# Altium schematic sheet ArmPcb.SchDoc
size A2
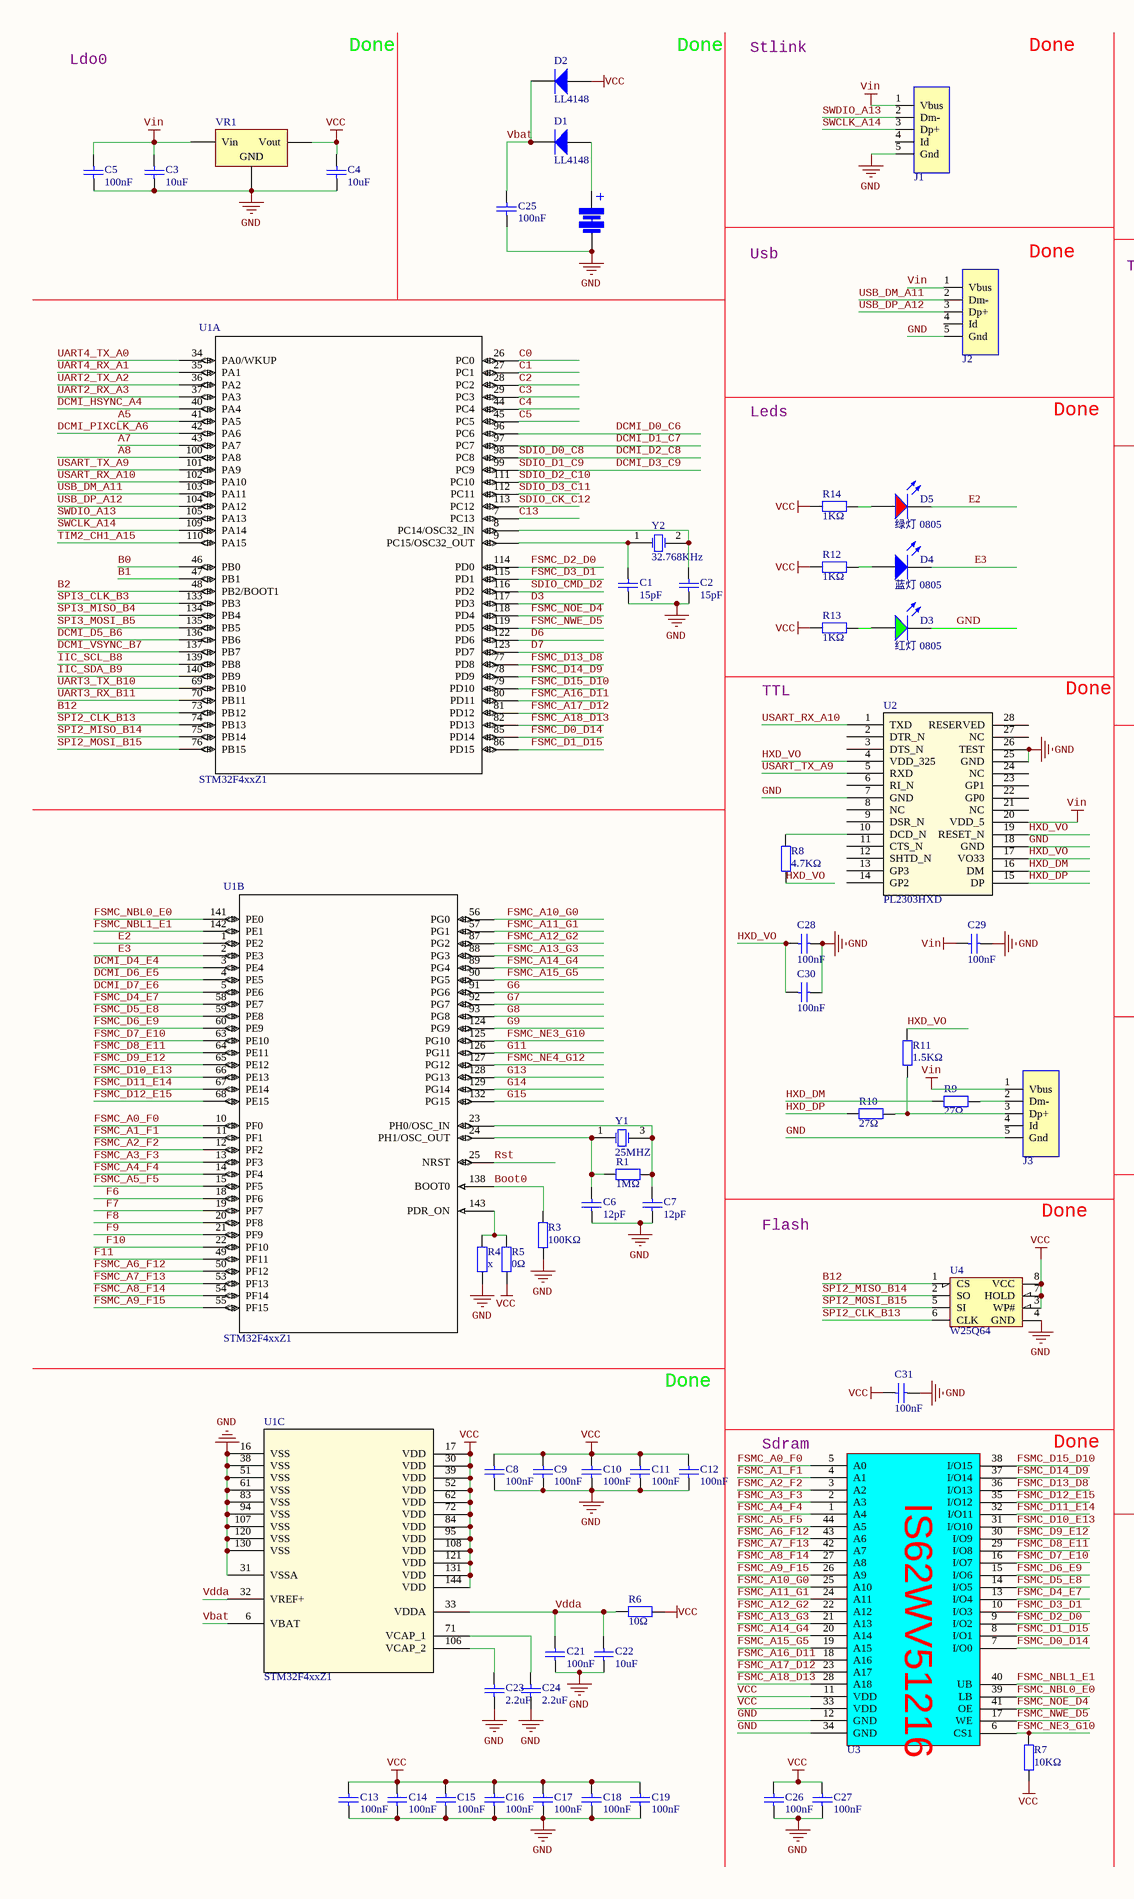
[diagram p0: ArmPcb.SchDoc, left]
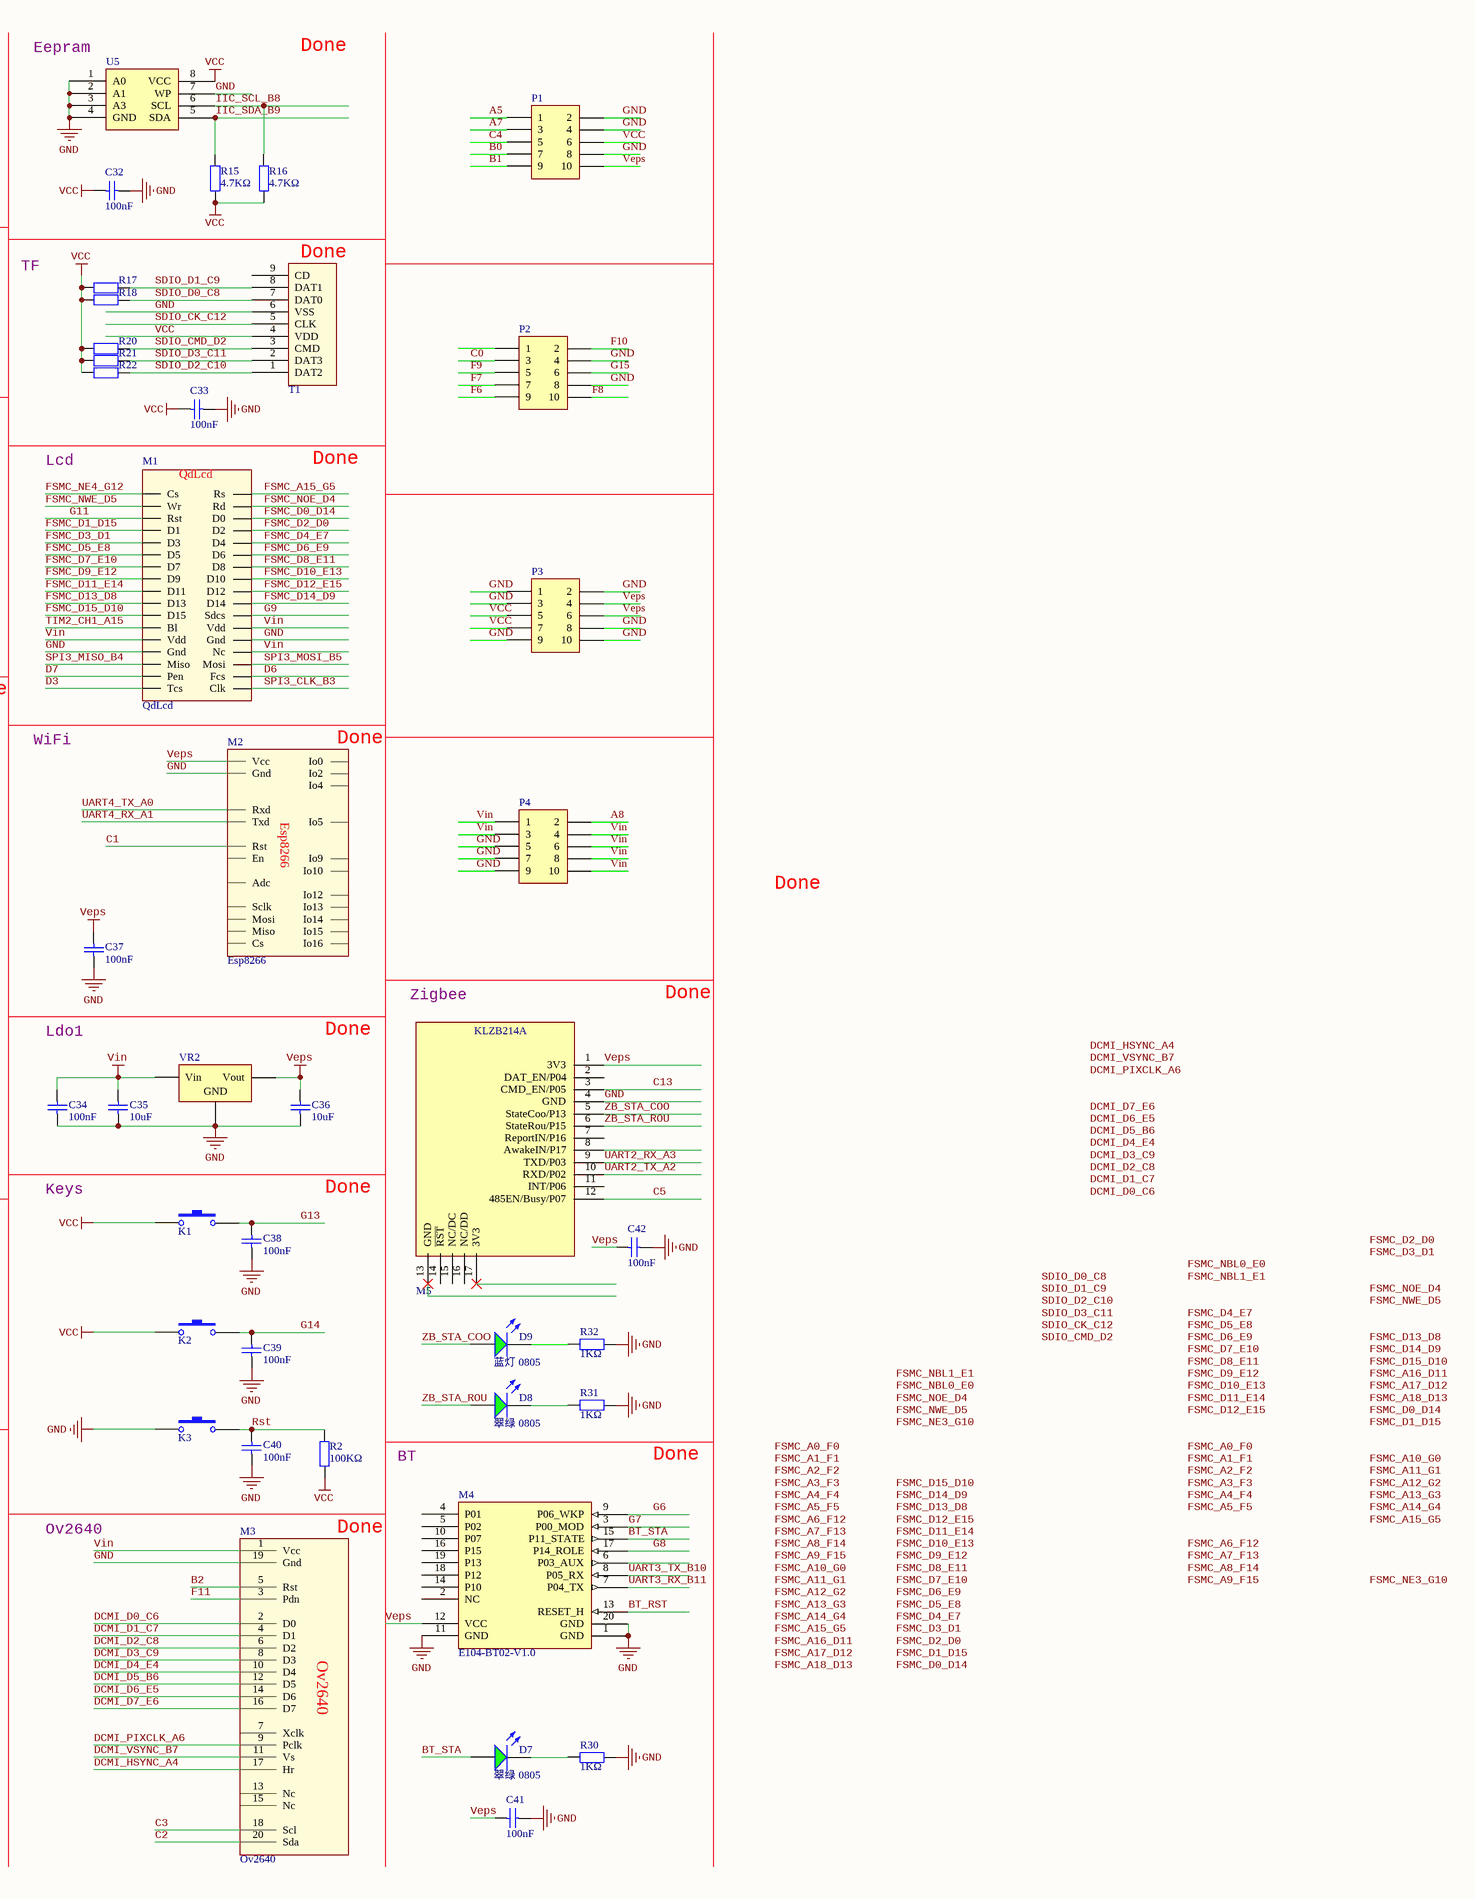
[diagram p1: ArmPcb.SchDoc, right]

## Parts
B1  BATTERY  [BATTERY]  (value not drawn)
C1  15pF  [0603_C]
C2  15pF  [0603_C]
C3  10uF  [0805_C]
C4  10uF  [0805_C]
C5  100nF  [0603_C]
C6  12pF  [0603_C]
C7  12pF  [0603_C]
C8  100nF  [0603_C]
C9  100nF  [0603_C]
C10  100nF  [0603_C]
C11  100nF  [0603_C]
C12  100nF  [0603_C]
C13  100nF  [0603_C]
C14  100nF  [0603_C]
C15  100nF  [0603_C]
C16  100nF  [0603_C]
C17  100nF  [0603_C]
C18  100nF  [0603_C]
C19  100nF  [0603_C]
C21  100nF  [0603_C]
C22  10uF  [0603_C]
C23  2.2uF  [0603_C]
C24  2.2uF  [0603_C]
C25  100nF  [0603_C]
C26  100nF  [0603_C]
C27  100nF  [0603_C]
C28  100nF  [0603_C]
C29  100nF  [0603_C]
C30  100nF  [0603_C]
C31  100nF  [0603_C]
C32  100nF  [0603_C]
C33  100nF  [0603_C]
C34  100nF  [0603_C]
C35  10uF  [0805_C]
C36  10uF  [0805_C]
C37  100nF  [0603_C]
C38  100nF  [0603_C]
C39  100nF  [0603_C]
C40  100nF  [0603_C]
C41  100nF  [0603_C]
C42  100nF  [0603_C]
D1  LL4148  [LL-34]
D2  LL4148  [LL-34]
D3  红灯 0805  [0805_LED_S1]
D4  蓝灯 0805  [0805_LED_S1]
D5  绿灯 0805  [0805_LED_S1]
D7  翠绿 0805  [0805_LED_S1]
D8  翠绿 0805  [0805_LED_S1]
D9  蓝灯 0805  [0805_LED_S1]
J1  UsbOtg  [USB-MINI-A]  (value not drawn)
J2  UsbOtg  [USB-MICRO_E]  (value not drawn)
J3  UsbOtg  [USB-MICRO_E]  (value not drawn)
K1  SW  [SWITCH]  (value not drawn)
K2  SW  [SWITCH]  (value not drawn)
K3  SW  [SWITCH]  (value not drawn)
M1  QdLcd  [TFTLCD]
M2  Esp8266  [ESP8266]
M3  Ov2640  [FPC0.5 OV2640]
M4  E104-BT02-V1.0  [PE104-BT02]
M5  KLZB214A  [KLZB214A_M]  (value not drawn)
P1  Header 5X2  [HDR2.54-M-LS-2x5P]  (value not drawn)
P2  Header 5X2  [HDR2.54-M-LS-2x5P]  (value not drawn)
P3  Header 5X2  [HDR2.54-M-LS-2x5P]  (value not drawn)
P4  Header 5X2  [HDR2.54-M-LS-2x5P]  (value not drawn)
R1  1MΩ  [0603_R]
R2  100KΩ  [0603_R]
R3  100KΩ  [0603_R]
R4  x  [0603_R]
R5  0Ω  [0603_R]
R6  10Ω  [0603_R]
R7  10KΩ  [0603_R]
R8  4.7KΩ  [0603_R]
R9  27Ω  [0603_R]
R10  27Ω  [0603_R]
R11  1.5KΩ  [0603_R]
R12  1KΩ  [0603_R]
R13  1KΩ  [0603_R]
R14  1KΩ  [0603_R]
R15  4.7KΩ  [0603_R]
R16  4.7KΩ  [0603_R]
R17  47KΩ  [0603_R]  (value not drawn)
R18  47KΩ  [0603_R]  (value not drawn)
R20  47KΩ  [0603_R]  (value not drawn)
R21  47KΩ  [0603_R]  (value not drawn)
R22  47KΩ  [0603_R]  (value not drawn)
R30  1KΩ  [0603_R]
R31  1KΩ  [0603_R]
R32  1KΩ  [0603_R]
T1  TFCard  [TF-CARD]  (value not drawn)
U1  STM32F4xxZ1  [LQFP144]  (parts A,B,C of 3)
U2  PL2303HXD  [SSOP28]
U3  IS62WV51216  [TSOP44]  (value not drawn)
U4  W25Q64  [SOP8_W]
U5  EAT24C256C  [SOP8_L]  (value not drawn)
VR1  AMS1117-3.3  [SOT-223]  (value not drawn)
VR2  AMS1117-3.3  [SOT-223]  (value not drawn)
Y1  25MHZ  [SMD-3225_4P]
Y2  32.768KHz  [SMD-3215_2P FC - 135]

## Nets
GND: B1.2(-) C1.1 C2.1 C3.1 C4.1 C5.1 C6.1 C7.1 C8.1 C9.1 C10.1 C11.1 C12.1 C13.1 C14.1 C15.1 C16.1 C17.1 C18.1 C19.1 C21.1 C22.1 C23.1 C24.1 C25.1 C26.1 C27.1 C28.1 C29.1 C30.1 C31.2 C32.2 C33.2 C34.1 C35.1 C36.1 C37.1 C38.1 C39.1 C40.1 C41.1 C42.1 D3.K J1.5(Gnd) J2.5(Gnd) J3.5(Gnd) K3.1 M1.26(Gnd) M1.27(Gnd) M2.15(Gnd) M3.19(Gnd) M4.1(GND) M4.11(GND) M4.20(GND) M5.4(GND) P1.2 P1.4 P1.8 P2.4 P2.8 P3.1 P3.2 P3.3 P3.8 P3.9 P3.10 P4.5 P4.7 P4.9 R3.1 R4.1 R30.1 R31.1 R32.1 T1.6(VSS) U1.16(VSS) U1.31(VSSA) U1.38(VSS) U1.51(VSS) U1.61(VSS) U1.83(VSS) U1.94(VSS) U1.107(VSS) U1.120(VSS) U1.130(VSS) U2.7(GND) U2.18(GND) U2.25(GND) U2.26(TEST) U3.12(GND) U3.34(GND) U4.4(GND) U5.1(A0) U5.2(A1) U5.3(A3) U5.4(GND) U5.7(WP) VR1.1(GND) VR2.1(GND)
VCC: C4.2 C8.2 C9.2 C10.2 C11.2 C12.2 C13.2 C14.2 C15.2 C16.2 C17.2 C18.2 C19.2 C26.2 C27.2 C31.1 C32.1 C33.1 D2.1(A) K1.1 K2.1 P1.6 P3.5 P3.7 R2.1 R5.1 R6.2 R7.1 R12.2 R13.2 R14.2 R15.2 R16.2 R17.1 R18.1 R20.1 R21.1 R22.1 T1.4(VDD) U1.17(VDD) U1.30(VDD) U1.39(VDD) U1.52(VDD) U1.62(VDD) U1.72(VDD) U1.84(VDD) U1.95(VDD) U1.108(VDD) U1.121(VDD) U1.131(VDD) U1.144(VDD) U3.11(VDD) U3.33(VDD) U4.3(WP#) U4.7(HOLD) U4.8(VCC) U5.8(VCC) VR1.2(Vout)
Veps: C36.2 C37.2 C41.2 C42.2 M2.8(Vcc) M4.12(VCC) M5.1(3V3) P1.10 P3.4 P3.6 VR2.2(Vout)
Vin: C3.2 C5.2 C29.2 C34.2 C35.2 J1.1(Vbus) J2.1(Vbus) J3.1(Vbus) M1.24(Vdd) M1.25(Vdd) M1.28(Nc) M3.1(Vcc) P4.1 P4.3 P4.4 P4.6 P4.8 P4.10 U2.20(VDD_5) VR1.3(Vin) VR2.3(Vin)
A5: P1.1 U1.41(PA5)
A7: P1.3 U1.43(PA7)
A8: P4.2 U1.100(PA8)
B0: P1.7 U1.46(PB0)
B1: P1.9 U1.47(PB1)
B2: M3.5(Rst) U1.48(PB2/BOOT1)
B12: U1.73(PB12) U4.1(CS)
Boot0: R3.2 U1.138(BOOT0)
BT_RST: M4.13(RESET_H)
BT_STA: D7.A M4.15(P11_STATE)
C0: P2.3 U1.26(PC0)
C1: M2.1(Rst) U1.27(PC1)
C2: M3.20(Sda) U1.28(PC2)
C3: M3.18(Scl) U1.29(PC3)
C4: P1.5 U1.44(PC4)
C5: M5.12(485EN/Busy/P07) U1.45(PC5)
C13: M5.3(CMD_EN/P05) U1.7(PC13)
D3: M1.33(Tcs) U1.117(PD3)
D6: M1.32(Fcs) U1.122(PD6)
D7: M1.31(Pen) U1.123(PD7)
DCMI_D0_C6: M3.2(D0) U1.96(PC6)
DCMI_D1_C7: M3.4(D1) U1.97(PC7)
DCMI_D2_C8: M3.6(D2) R18.2 T1.7(DAT0) U1.98(PC8)  [also labelled SDIO_D0_C8]
DCMI_D3_C9: M3.8(D3) R17.2 T1.8(DAT1) U1.99(PC9)  [also labelled SDIO_D1_C9]
DCMI_D4_E4: M3.10(D4) U1.3(PE4)
DCMI_D5_B6: M3.12(D5) U1.136(PB6)
DCMI_D6_E5: M3.14(D6) U1.4(PE5)
DCMI_D7_E6: M3.16(D7) U1.5(PE6)
DCMI_HSYNC_A4: M3.17(Hr) U1.40(PA4)
DCMI_PIXCLK_A6: M3.9(Pclk) U1.42(PA6)
DCMI_VSYNC_B7: M3.11(Vs) U1.137(PB7)
E2: D5.K U1.1(PE2)
E3: D4.K U1.2(PE3)
F6: P2.9 U1.18(PF6)
F7: P2.7 U1.19(PF7)
F8: P2.10 U1.20(PF8)
F9: P2.5 U1.21(PF9)
F10: P2.2 U1.22(PF10)
F11: M3.3(Pdn) U1.49(PF11)
FSMC_A0_F0: U1.10(PF0) U3.5(A0)
FSMC_A1_F1: U1.11(PF1) U3.4(A1)
FSMC_A2_F2: U1.12(PF2) U3.3(A2)
FSMC_A3_F3: U1.13(PF3) U3.2(A3)
FSMC_A4_F4: U1.14(PF4) U3.1(A4)
FSMC_A5_F5: U1.15(PF5) U3.44(A5)
FSMC_A6_F12: U1.50(PF12) U3.43(A6)
FSMC_A7_F13: U1.53(PF13) U3.42(A7)
FSMC_A8_F14: U1.54(PF14) U3.27(A8)
FSMC_A9_F15: U1.55(PF15) U3.26(A9)
FSMC_A10_G0: U1.56(PG0) U3.25(A10)
FSMC_A11_G1: U1.57(PG1) U3.24(A11)
FSMC_A12_G2: U1.87(PG2) U3.22(A12)
FSMC_A13_G3: U1.88(PG3) U3.21(A13)
FSMC_A14_G4: U1.89(PG4) U3.20(A14)
FSMC_A15_G5: M1.2(Rs) U1.90(PG5) U3.19(A15)
FSMC_A16_D11: U1.80(PD11) U3.18(A16)
FSMC_A17_D12: U1.81(PD12) U3.23(A17)
FSMC_A18_D13: U1.82(PD13) U3.28(A18)
FSMC_D0_D14: M1.6(D0) U1.85(PD14) U3.7(I/O0)
FSMC_D1_D15: M1.7(D1) U1.86(PD15) U3.8(I/O1)
FSMC_D2_D0: M1.8(D2) U1.114(PD0) U3.9(I/O2)
FSMC_D3_D1: M1.9(D3) U1.115(PD1) U3.10(I/O3)
FSMC_D4_E7: M1.10(D4) U1.58(PE7) U3.13(I/O4)
FSMC_D5_E8: M1.11(D5) U1.59(PE8) U3.14(I/O5)
FSMC_D6_E9: M1.12(D6) U1.60(PE9) U3.15(I/O6)
FSMC_D7_E10: M1.13(D7) U1.63(PE10) U3.16(I/O7)
FSMC_D8_E11: M1.14(D8) U1.64(PE11) U3.29(I/O8)
FSMC_D9_E12: M1.15(D9) U1.65(PE12) U3.30(I/O9)
FSMC_D10_E13: M1.16(D10) U1.66(PE13) U3.31(I/O10)
FSMC_D11_E14: M1.17(D11) U1.67(PE14) U3.32(I/O11)
FSMC_D12_E15: M1.18(D12) U1.68(PE15) U3.35(I/O12)
FSMC_D13_D8: M1.19(D13) U1.77(PD8) U3.36(I/O13)
FSMC_D14_D9: M1.20(D14) U1.78(PD9) U3.37(I/O14)
FSMC_D15_D10: M1.21(D15) U1.79(PD10) U3.38(I/O15)
FSMC_NBL0_E0: U1.141(PE0) U3.39(LB)
FSMC_NBL1_E1: U1.142(PE1) U3.40(UB)
FSMC_NE3_G10: R7.2 U1.125(PG10) U3.6(CS1)
FSMC_NE4_G12: M1.1(Cs) U1.127(PG12)
FSMC_NOE_D4: M1.4(Rd) U1.118(PD4) U3.41(OE)
FSMC_NWE_D5: M1.3(Wr) U1.119(PD5) U3.17(WE)
G6: M4.9(P06_WKP) U1.91(PG6)
G7: M4.3(P00_MOD) U1.92(PG7)
G8: M4.17(P14_ROLE) U1.93(PG8)
G9: M1.22(Sdcs) U1.124(PG9)
G11: M1.5(Rst) U1.126(PG11)
G13: C38.2 K1.2 U1.128(PG13)
G14: C39.2 K2.2 U1.129(PG14)
G15: P2.6 U1.132(PG15)
HXD_DM: R9.1 U2.16(DM)
HXD_DP: R10.1 U2.15(DP)
HXD_VO: C28.2 C30.2 R8.2 R11.2 U2.4(VDD_325) U2.17(VO33) U2.19(RESET_N)
IIC_SCL_B8: R16.1 U1.139(PB8) U5.6(SCL)
IIC_SDA_B9: R15.1 U1.140(PB9) U5.5(SDA)
Rst: C40.2 K3.2 R2.2 U1.25(NRST)
SDIO_CK_C12: T1.5(CLK) U1.113(PC12)
SDIO_CMD_D2: R20.2 T1.3(CMD) U1.116(PD2)
SDIO_D2_C10: R22.2 T1.1(DAT2) U1.111(PC10)
SDIO_D3_C11: R21.2 T1.2(DAT3) U1.112(PC11)
SPI2_CLK_B13: U1.74(PB13) U4.6(CLK)
SPI2_MISO_B14: U1.75(PB14) U4.2(SO)
SPI2_MOSI_B15: U1.76(PB15) U4.5(SI)
SPI3_CLK_B3: M1.34(Clk) U1.133(PB3)
SPI3_MISO_B4: M1.29(Miso) U1.134(PB4)
SPI3_MOSI_B5: M1.30(Mosi) U1.135(PB5)
SWCLK_A14: J1.3(Dp+) U1.109(PA14)
SWDIO_A13: J1.2(Dm-) U1.105(PA13)
TIM2_CH1_A15: M1.23(Bl) U1.110(PA15)
UART2_RX_A3: M5.9(TXD/P03) U1.37(PA3)
UART2_TX_A2: M5.10(RXD/P02) U1.36(PA2)
UART3_RX_B11: M4.7(P04_TX) U1.70(PB11)
UART3_TX_B10: M4.8(P05_RX) U1.69(PB10)
UART4_RX_A1: M2.22(Txd) U1.35(PA1)
UART4_TX_A0: M2.21(Rxd) U1.34(PA0/WKUP)
USART_RX_A10: U1.102(PA10) U2.1(TXD)
USART_TX_A9: U1.101(PA9) U2.5(RXD)
USB_DM_A11: J2.2(Dm-) U1.103(PA11)
USB_DP_A12: J2.3(Dp+) U1.104(PA12)
Vbat: C25.2 D1.2(K) D2.2(K) U1.6(VBAT)
Vdda: C21.2 C22.2 R6.1 U1.32(VREF+) U1.33(VDDA)
ZB_STA_COO: D9.A M5.5(StateCoo/P13)
ZB_STA_ROU: D8.A M5.6(StateRou/P15)
NetB1_1: B1.1(+) D1.1(A)
NetC1_2: C1.2 U1.9(PC15/OSC32_OUT) Y2.1(OSC1)
NetC2_2: C2.2 U1.8(PC14/OSC32_IN) Y2.2(OSC2)
NetC6_2: C6.2 R1.1 U1.24(PH1/OSC_OUT) Y1.1(OSC1)
NetC7_2: C7.2 R1.2 U1.23(PH0/OSC_IN) Y1.3(OSC2)
NetC23_2: C23.2 U1.106(VCAP_2)
NetC24_2: C24.2 U1.71(VCAP_1)
NetD3_A: D3.A R13.1
NetD4_A: D4.A R12.1
NetD5_A: D5.A R14.1
NetD7_K: D7.K R30.2
NetD8_K: D8.K R31.2
NetD9_K: D9.K R32.2
NetJ3_2: J3.2(Dm-) R9.2
NetJ3_3: J3.3(Dp+) R10.2 R11.1
NetR4_2: R4.2 R5.2 U1.143(PDR_ON)
NetR8_1: R8.1 U2.10(DCD_N)

Not connected (* = marked no-connect by the designer): J1 4(Id); J2 4(Id); J3 4(Id); M2 2(Adc) 3(En) 4(Io16) 5(Io14) 6(Io12) 7(Io13) 9(Sclk) 10(Mosi) 11(Io10) 12(Io9) 13(Miso) 14(Cs) 16(Io15) 17(Io2) 18(Io0) 19(Io4) 20(Io5); M3 7(Xclk) 13(Nc) 15(Nc); M4 2(NC) 4(P01) 5(P02) 6(P03_AUX) 10(P07) 14(P10) 16(P15) 18(P12) 19(P13); M5 2(DAT_EN/P04) 7(ReportIN/P16) 8(AwakeIN/P17) 11(INT/P06) 13(GND)* 14(~{RST}) 15(NC/DC) 16(NC/DD) 17(3V3)*; P2 1; T1 9(CD); U2 2(DTR_N) 3(DTS_N) 6(RI_N) 8(NC) 9(DSR_N) 11(CTS_N) 12(SHTD_N) 13(GP3) 14(GP2) 21(NC) 22(GP0) 23(GP1) 24(NC) 27(NC) 28(RESERVED)

## Notes on the sheet
- Ldo0
- Done
- Stlink
- (near U5) Eepram
- Usb
- TF
- (near T1) Done
- Leds
- Lcd
- TTL
- WiFi
- (near M2) Done
- Zigbee
- Ldo1
- Keys
- Flash
- Sdram
- BT
- Ov2640
- Labels drawn without touching a wire or pin: DCMI_D0_C6, DCMI_D1_C7, DCMI_D2_C8, DCMI_D3_C9, DCMI_D4_E4, DCMI_D5_B6, DCMI_D6_E5, DCMI_D7_E6, DCMI_HSYNC_A4, DCMI_PIXCLK_A6, DCMI_VSYNC_B7, FSMC_A0_F0, FSMC_A1_F1, FSMC_A2_F2, FSMC_A3_F3, FSMC_A4_F4, FSMC_A5_F5, FSMC_A6_F12, FSMC_A7_F13, FSMC_A8_F14, FSMC_A9_F15, FSMC_A10_G0, FSMC_A11_G1, FSMC_A12_G2, FSMC_A13_G3, FSMC_A14_G4, FSMC_A15_G5, FSMC_A16_D11, FSMC_A17_D12, FSMC_A18_D13, FSMC_D0_D14, FSMC_D1_D15, FSMC_D2_D0, FSMC_D3_D1, FSMC_D4_E7, FSMC_D5_E8, FSMC_D6_E9, FSMC_D7_E10, FSMC_D8_E11, FSMC_D9_E12, FSMC_D10_E13, FSMC_D11_E14, FSMC_D12_E15, FSMC_D13_D8, FSMC_D14_D9, FSMC_D15_D10, FSMC_NBL0_E0, FSMC_NBL1_E1, FSMC_NE3_G10, FSMC_NOE_D4, FSMC_NWE_D5, SDIO_CK_C12, SDIO_CMD_D2, SDIO_D0_C8, SDIO_D1_C9, SDIO_D2_C10, SDIO_D3_C11
- Title
- Size:
- Date:
- File:
- A2
- Number:
- Time:
- Revision:
- Sheet
- of

## Library data of the parts
B1 = BATTERY: 纽扣电池
C1 C2 = 0603 15pF (150) 5% 50V: 贴片电容; ComponentLink1Description: 供应商链接; ComponentLink1URL: http://www.szlcsc.com/product/details_1996.html; Package: 0603; Supplier: LC; SuppliersPartNumber: C1644
C3 C4 C35 C36 = 0805 10uF (106) 10% 25V: 贴片电容; ComponentLink1Description: 供应商链接; ComponentLink1URL: http://www.szlcsc.com/product/details_16532.html; Package: 0805; Supplier: LC; SuppliersPartNumber: C15850
C5 C8-C19 C21 C25-C34 C37-C42 = 0603 100nF (104) 10% 50V: 贴片电容; ComponentLink1Description: 供应商链接; ComponentLink1URL: http://www.szlcsc.com/product/details_15331.html; Package: 0603; Supplier: LC; SuppliersPartNumber: C14663
C6 C7 = 0603 12pF (120) 5% 50V: 贴片电容; ComponentLink1Description: 供应商链接; ComponentLink1URL: http://www.szlcsc.com/product/details_39506.html; Package: 0603; Supplier: LC; SuppliersPartNumber: C38523
C22 = 0603 10uF (106) 10% 10V: 贴片电容; ComponentLink1Description: 供应商链接; ComponentLink1URL: http://www.szlcsc.com/product/details_20411.html; Package: 0603; Supplier: LC; SuppliersPartNumber: C19702
C23 C24 = 0603 2.2uF (225) 10% 16V: 贴片电容; ComponentLink1Description: 供应商链接; ComponentLink1URL: http://www.szlcsc.com/product/details_24366.html; Package: 0603; Supplier: LC; SuppliersPartNumber: C23630
D1 D2 = LL-34 LL4148 LL-34 1206: 开关二极管; ComponentLink1Description: 供应商链接; ComponentLink1URL: http://www.szlcsc.com/product/details_10338.html; Package: LL-34; Supplier: LC; SuppliersPartNumber: C9808
D3 D7-D9 = 0805 翠绿: 发光二极管; ComponentLink1Description: 供应商链接; ComponentLink1URL: http://www.szlcsc.com/product/details_2670.html; Package: 0805; Supplier: LC; SuppliersPartNumber: C2297
D4 = 0805 蓝灯: 发光二极管; ComponentLink1Description: 供应商链接; ComponentLink1URL: http://www.szlcsc.com/product/details_2666.html; Package: 0805; Supplier: LC; SuppliersPartNumber: C2293
D5 = 0805 红灯: 发光二极管; ComponentLink1Description: 供应商链接; ComponentLink1URL: http://www.szlcsc.com/product/details_2668.html; Package: 0805; Supplier: LC; SuppliersPartNumber: C2295
K1-K3 = SW: Switch
M5 = KLZB214A: zigbee to uart
P1-P4 = Header 5X2: Header, 5-Pin, Dual row; LatestRevisionDate: 17-Jul-2002; LatestRevisionNote: Re-released for DXP Platform.; Publisher: Altium Limited
R1 = 0603 1MΩ (1004) 1%: 贴片电阻; ComponentLink1Description: 供应商链接; ComponentLink1URL: http://www.szlcsc.com/product/details_23662.html; Package: 0603; Supplier: LC; SuppliersPartNumber: C22935
R2 R3 = 0603 100KΩ (1003) 1%: 贴片电阻; ComponentLink1Description: 供应商链接; ComponentLink1URL: http://www.szlcsc.com/product/details_26546.html; Package: 0603; Supplier: LC; SuppliersPartNumber: C25803
R4 R5 = 0603 0Ω (0R0) 1%: 贴片电阻; ComponentLink1Description: 供应商链接; ComponentLink1URL: http://www.szlcsc.com/product/details_21903.html; Package: 0603; Supplier: LC; SuppliersPartNumber: C21189
R6 = 0603 10Ω (10R0) 1%: 贴片电阻; ComponentLink1Description: 供应商链接; ComponentLink1URL: http://www.szlcsc.com/product/details_23586.html; Package: 0603; Supplier: LC; SuppliersPartNumber: C22859
R7-R16 R30-R32 = 0603 10KΩ (1002) 1%: 贴片电阻; ComponentLink1Description: 供应商链接; ComponentLink1URL: http://www.szlcsc.com/product/details_26547.html; Package: 0603; Supplier: LC; SuppliersPartNumber: C25804
R17 R18 R20-R22 = 0603 47KΩ (4702) 1%: 贴片电阻; ComponentLink1Description: 供应商链接; ComponentLink1URL: http://www.szlcsc.com/product/details_26562.html; Package: 0603; Supplier: LC; SuppliersPartNumber: C25819
U1 = STM32F4xxZ1: Imported; Vendor: STMicroelectronics; C: Copyright (C) 2016 Accelerated Designs. All rights reserved; Manufacturer_Part_Number: stm32f4xxz1; Copyright: Copyright (C) 2016 Accelerated Designs. All rights reserved; RefDes: RefDes; Type: Type; Value: Value
U2 = PL2303HXD: Driver; Manufacturer_Part_Number: tlc5916-q1_d_16; GENERIC_PART_NUMBER: TLC5916-Q1; Vendor: Texas Instruments; PACKAGE_DESIGNATOR: D; PIN_COUNT: 16; FAMILY_NAME: LED DRIVER; INDUSTRY_STD_PKG_TYPE: SOIC; Manufacturer: Texas Instruments; Datasheet_URL: http://www.ti.com/lit/gpn/TLC5916-Q1; Value: Value; Type: Type; RefDes: RefDes
U3 = IS62WV51216: 外部SRAM
U4 = W25X16: W25X16;SST25VF016;MX25L1605
U5 = AT24C256C: EEPROM; ComponentLink1Description: 供应商链接; ComponentLink1URL: http://www.szlcsc.com/product/details_6947.html; Package: SOIC-8_150mil; Supplier: LC; SuppliersPartNumber: C6482
VR1 VR2 = SOT-223 AMS1117-3.3: 低压差线性稳压(LDO); ComponentLink1Description: 供应商链接; ComponentLink1URL: http://www.szlcsc.com/product/details_6652.html; Package: SOT-223; Supplier: LC; SuppliersPartNumber: C6186
Y1 = SMD-3225_4P  25MHZ 12PF 10PPM: 贴片晶振; ComponentLink1Description: 供应商链接; ComponentLink1URL: http://www.szlcsc.com/product/details_9526.html; Package: SMD-3225_4P; Supplier: LC; SuppliersPartNumber: C9006
Y2 = SMD-3215_2P 32.768KHz 20ppm 12.5pF: 贴片晶振; ComponentLink1Description: 供应商链接; ComponentLink1URL: http://www.szlcsc.com/product/details_33310.html; Package: SMD-3215_2P; Supplier: LC; SuppliersPartNumber: C32346